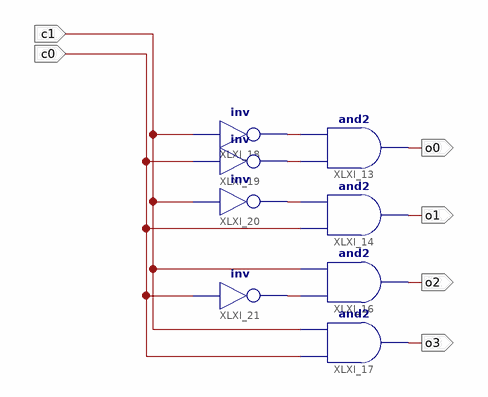
[diagram p0: schematic sheet 1]
// Xilinx ISE schematic decoder2to4.sch (spartan6) as structural Verilog: 8 symbols, 6 ports
module decoder2to4 (
  input  c1,
  input  c0,
  output o0,
  output o1,
  output o2,
  output o3
);

  wire XLXN_13, XLXN_14, XLXN_15, XLXN_16;

  and XLXI_13 (o0, XLXN_14, XLXN_13);
  and XLXI_14 (o1, c0, XLXN_15);
  and XLXI_16 (o2, XLXN_16, c1);
  and XLXI_17 (o3, c0, c1);
  not XLXI_18 (XLXN_13, c1);
  not XLXI_19 (XLXN_14, c0);
  not XLXI_20 (XLXN_15, c1);
  not XLXI_21 (XLXN_16, c0);
endmodule
